# Altium schematic sheet Electrical Schematic.SchDoc
size A4; SheetNumber: 1; SheetTotal: 1
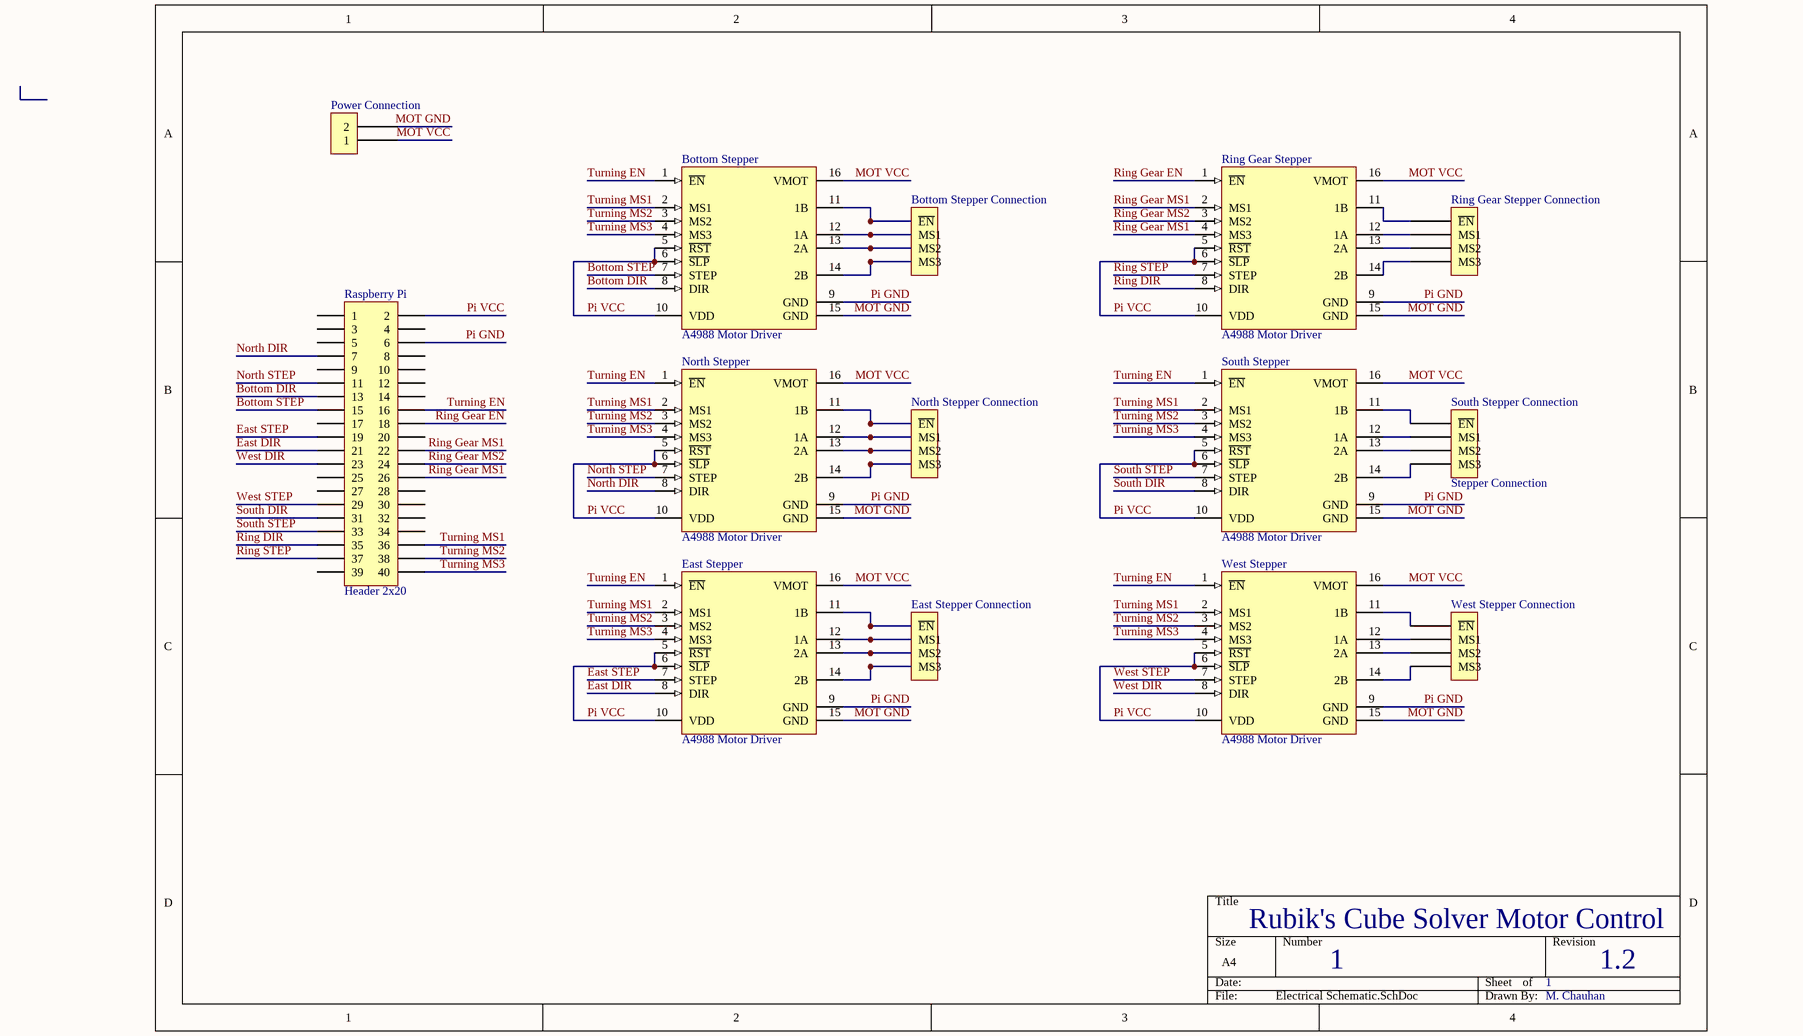
[diagram p0: Electrical Schematic.SchDoc]

## Parts
Bottom_Stepper  A4988 Motor Driver  [Polo-A4988 Motor Driver_V]
Bottom_Stepper_Connection  (no value)  [Header 1x4 male]
East_Stepper  A4988 Motor Driver  [Polo-A4988 Motor Driver_V]
East_Stepper_Connection  (no value)  [Header 1x4 male]
North_Stepper  A4988 Motor Driver  [Polo-A4988 Motor Driver_V]
North_Stepper_Connection  (no value)  [Header 1x4 male]
Power_Connection  (no value)  [Header 1x2+1 1.0mm]
Raspberry_Pi  Header 2x20  [Header 2x20 MALE]
Ring_Gear_Stepper  A4988 Motor Driver  [Polo-A4988 Motor Driver_V]
Ring_Gear_Stepper_Connection  (no value)  [Header 1x4 male]
South_Stepper  A4988 Motor Driver  [Polo-A4988 Motor Driver_V]
South_Stepper_Connection  Stepper Connection  [Header 1x4 male]
West_Stepper  A4988 Motor Driver  [Polo-A4988 Motor Driver_V]
West_Stepper_Connection  (no value)  [Header 1x4 male]

## Nets
Bottom DIR: Bottom_Stepper.8(DIR) Raspberry_Pi.13
Bottom STEP: Bottom_Stepper.7(STEP) Raspberry_Pi.15
East DIR: East_Stepper.8(DIR) Raspberry_Pi.21
East STEP: East_Stepper.7(STEP) Raspberry_Pi.19
MOT GND: Bottom_Stepper.15(GND) East_Stepper.15(GND) North_Stepper.15(GND) Power_Connection.2 Ring_Gear_Stepper.15(GND) South_Stepper.15(GND) West_Stepper.15(GND)
MOT VCC: Bottom_Stepper.16(VMOT) East_Stepper.16(VMOT) North_Stepper.16(VMOT) Power_Connection.1 Ring_Gear_Stepper.16(VMOT) South_Stepper.16(VMOT) West_Stepper.16(VMOT)
North DIR: North_Stepper.8(DIR) Raspberry_Pi.7
North STEP: North_Stepper.7(STEP) Raspberry_Pi.11
Pi GND: Bottom_Stepper.9(GND) East_Stepper.9(GND) North_Stepper.9(GND) Raspberry_Pi.6 Ring_Gear_Stepper.9(GND) South_Stepper.9(GND) West_Stepper.9(GND)
Pi VCC: Bottom_Stepper.5(~{RST}) Bottom_Stepper.6(~{SLP}) Bottom_Stepper.10(VDD) East_Stepper.5(~{RST}) East_Stepper.6(~{SLP}) East_Stepper.10(VDD) North_Stepper.5(~{RST}) North_Stepper.6(~{SLP}) North_Stepper.10(VDD) Raspberry_Pi.2 Ring_Gear_Stepper.5(~{RST}) Ring_Gear_Stepper.6(~{SLP}) Ring_Gear_Stepper.10(VDD) South_Stepper.5(~{RST}) South_Stepper.6(~{SLP}) South_Stepper.10(VDD) West_Stepper.5(~{RST}) West_Stepper.6(~{SLP}) West_Stepper.10(VDD)
Ring DIR: Raspberry_Pi.35 Ring_Gear_Stepper.8(DIR)
Ring Gear EN: Raspberry_Pi.18 Ring_Gear_Stepper.1(~{EN})
Ring Gear MS1: Raspberry_Pi.22 Raspberry_Pi.26 Ring_Gear_Stepper.2(MS1) Ring_Gear_Stepper.4(MS3)
Ring Gear MS2: Raspberry_Pi.24 Ring_Gear_Stepper.3(MS2)
Ring STEP: Raspberry_Pi.37 Ring_Gear_Stepper.7(STEP)
South DIR: Raspberry_Pi.31 South_Stepper.8(DIR)
South STEP: Raspberry_Pi.33 South_Stepper.7(STEP)
Turning EN: Bottom_Stepper.1(~{EN}) East_Stepper.1(~{EN}) North_Stepper.1(~{EN}) Raspberry_Pi.16 South_Stepper.1(~{EN}) West_Stepper.1(~{EN})
Turning MS1: Bottom_Stepper.2(MS1) East_Stepper.2(MS1) North_Stepper.2(MS1) Raspberry_Pi.36 South_Stepper.2(MS1) West_Stepper.2(MS1)
Turning MS2: Bottom_Stepper.3(MS2) East_Stepper.3(MS2) North_Stepper.3(MS2) Raspberry_Pi.38 South_Stepper.3(MS2) West_Stepper.3(MS2)
Turning MS3: Bottom_Stepper.4(MS3) East_Stepper.4(MS3) North_Stepper.4(MS3) Raspberry_Pi.40 South_Stepper.4(MS3) West_Stepper.4(MS3)
West DIR: Raspberry_Pi.23 West_Stepper.8(DIR)
West STEP: Raspberry_Pi.29 West_Stepper.7(STEP)
NetBottom_Stepper_11: Bottom_Stepper.11(1B) Bottom_Stepper_Connection.1(~{EN})
NetBottom_Stepper_12: Bottom_Stepper.12(1A) Bottom_Stepper_Connection.2(MS1)
NetBottom_Stepper_13: Bottom_Stepper.13(2A) Bottom_Stepper_Connection.3(MS2)
NetBottom_Stepper_14: Bottom_Stepper.14(2B) Bottom_Stepper_Connection.4(MS3)
NetEast_Stepper_11: East_Stepper.11(1B) East_Stepper_Connection.1(~{EN})
NetEast_Stepper_12: East_Stepper.12(1A) East_Stepper_Connection.2(MS1)
NetEast_Stepper_13: East_Stepper.13(2A) East_Stepper_Connection.3(MS2)
NetEast_Stepper_14: East_Stepper.14(2B) East_Stepper_Connection.4(MS3)
NetNorth_Stepper_11: North_Stepper.11(1B) North_Stepper_Connection.1(~{EN})
NetNorth_Stepper_12: North_Stepper.12(1A) North_Stepper_Connection.2(MS1)
NetNorth_Stepper_13: North_Stepper.13(2A) North_Stepper_Connection.3(MS2)
NetNorth_Stepper_14: North_Stepper.14(2B) North_Stepper_Connection.4(MS3)
NetRing_Gear_Stepper_11: Ring_Gear_Stepper.11(1B) Ring_Gear_Stepper_Connection.1(~{EN})
NetRing_Gear_Stepper_12: Ring_Gear_Stepper.12(1A) Ring_Gear_Stepper_Connection.2(MS1)
NetRing_Gear_Stepper_13: Ring_Gear_Stepper.13(2A) Ring_Gear_Stepper_Connection.3(MS2)
NetRing_Gear_Stepper_14: Ring_Gear_Stepper.14(2B) Ring_Gear_Stepper_Connection.4(MS3)
NetSouth_Stepper_11: South_Stepper.11(1B) South_Stepper_Connection.1(~{EN})
NetSouth_Stepper_12: South_Stepper.12(1A) South_Stepper_Connection.2(MS1)
NetSouth_Stepper_13: South_Stepper.13(2A) South_Stepper_Connection.3(MS2)
NetSouth_Stepper_14: South_Stepper.14(2B) South_Stepper_Connection.4(MS3)
NetWest_Stepper_11: West_Stepper.11(1B) West_Stepper_Connection.1(~{EN})
NetWest_Stepper_12: West_Stepper.12(1A) West_Stepper_Connection.2(MS1)
NetWest_Stepper_13: West_Stepper.13(2A) West_Stepper_Connection.3(MS2)
NetWest_Stepper_14: West_Stepper.14(2B) West_Stepper_Connection.4(MS3)

Not connected (* = marked no-connect by the designer): Raspberry_Pi 1 3 4 5 8 9 10 12 14 17 20 25 27 28 30 32 34 39

## Notes on the sheet
- Rubik's Cube Solver Motor Control
- 1
- 1.2
- M. Chauhan

## Library data of the parts
Bottom_Stepper East_Stepper North_Stepper Ring_Gear_Stepper South_Stepper West_Stepper = CMP-00024-00002-2: Stepper Motor Driver Carrier, 3 to 5.5 V, 2 A, 16-Pin THD; Manufacturer: Pololu Robotics & Electronics; Datasheet Version: Dec-15; Package Description: 16-Pin Through Hole Device, Body 20.3 x 15.2 mm, Pitch 2.54 mm; Case/Package: A4988MotorDriver; Mounting Technology: TH; RoHS Compliant: Unknown; Datasheet URL: https://www.pololu.com/file/0J1082/a4988-stepper-motor-driver-carrier-dimension-diagram.pdf; Package Reference: A4988 Motor Driver
Bottom_Stepper_Connection East_Stepper_Connection North_Stepper_Connection Ring_Gear_Stepper_Connection South_Stepper_Connection West_Stepper_Connection = Header 4x1
Power_Connection = Header 2x1